# Altium project MEGAphone.PrjPcb (part 2 of 2)

## Sheet Audio.SchDoc: AUDIO
size A4; DrawnBy: D KLEISS; Revision: 1; SheetNumber: 3; SheetTotal: 15
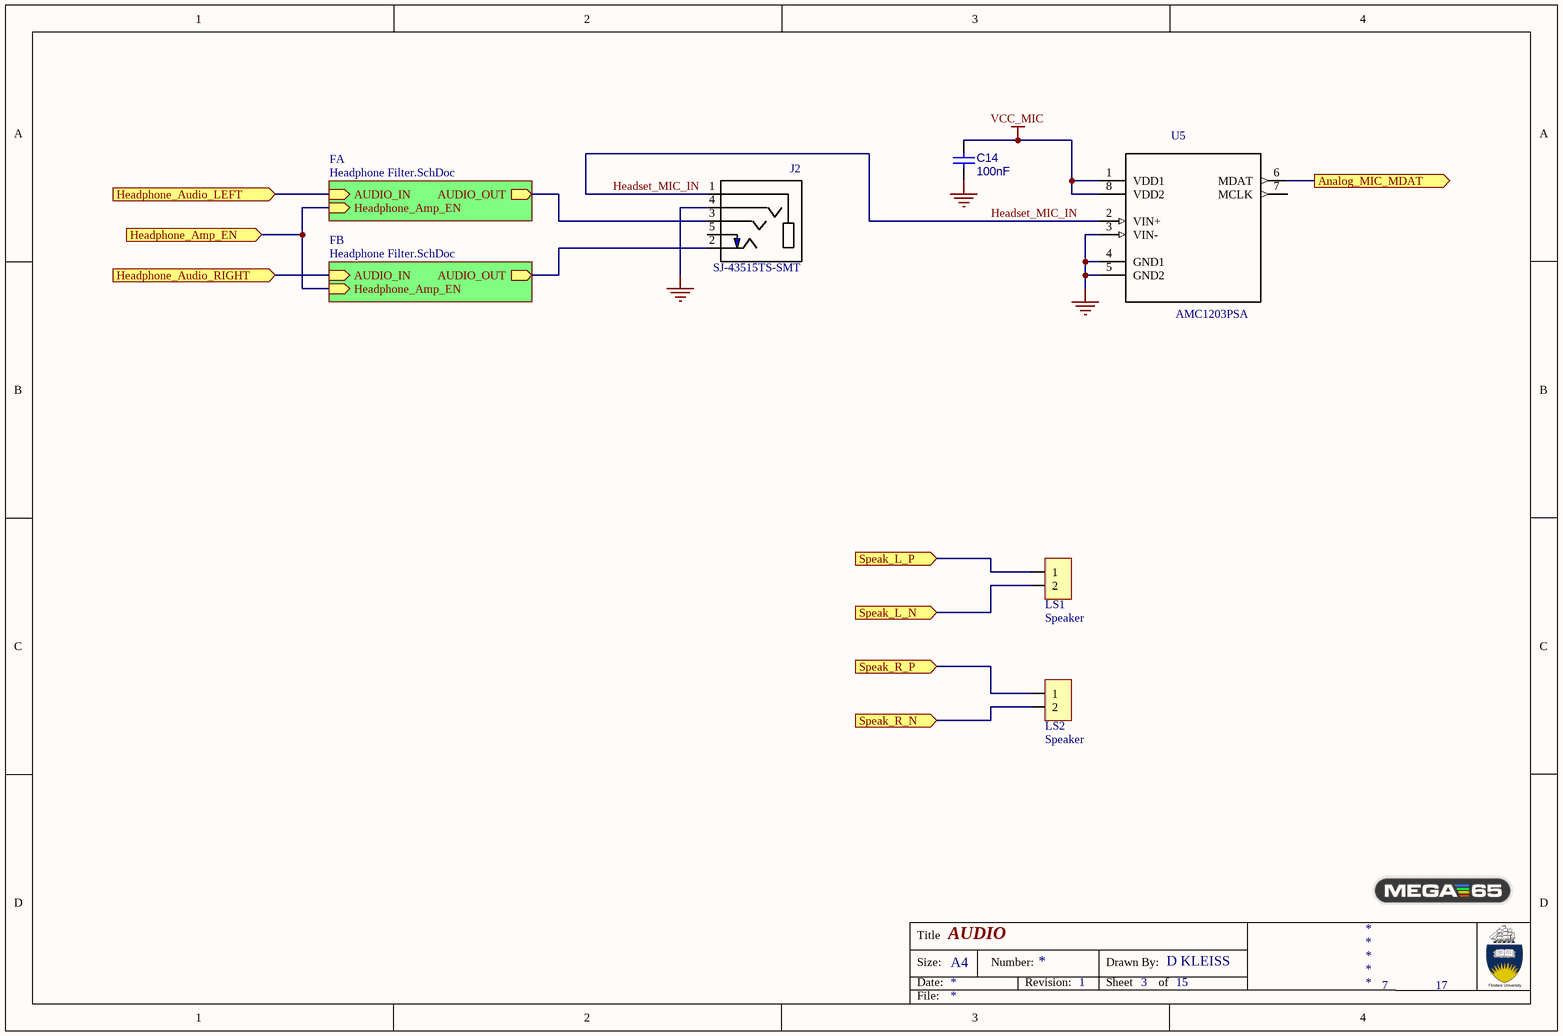
[diagram p9: Audio.SchDoc]

### Parts
C14  100nF  [0603_CAP UF HD]
J2  SJ-43515TS-SMT  [SOCKET 3.5 TRRS CUI_SJ-43515TS-SMT]
LS1  Speaker  [HDR1X2]
LS2  Speaker  [HDR1X2]
U5  AMC1203PSA  [AMC1203]

### Sub-sheets
FA = Headphone Filter.SchDoc: AUDIO_IN (in), AUDIO_OUT (out), Headphone_Amp_EN (in)
FB = Headphone Filter.SchDoc: AUDIO_IN (in), AUDIO_OUT (out), Headphone_Amp_EN (in)

### Ports
Analog_MIC_MDAT (out), Headphone_Amp_EN (in), Headphone_Audio_LEFT (in), Headphone_Audio_RIGHT (in), Speak_L_N (in), Speak_L_P (in), Speak_R_N (in), Speak_R_P (in)

### Nets
GND: C14.2 J2.4(RING2) U5.3(VIN-) U5.4(GND1) U5.5(GND2)
VCC_MIC: C14.1 U5.1(VDD1) U5.8(VDD2)
Headset_MIC_IN: J2.1(SLEEVE) U5.2(VIN+)
NetESP1_8: LS1.1 ; port Speak_L_P
NetESP1_10: LS1.2 ; port Speak_L_N
NetESP1_12: LS2.1 ; port Speak_R_P
NetESP1_14: LS2.2 ; port Speak_R_N
NetF2_FA_2: J2.3(RING1) ; sheet FA/AUDIO_OUT
NetF2_FB_2: J2.2(TIP) ; sheet FB/AUDIO_OUT
NetR17_FA_2: port Headphone_Audio_LEFT, sheet FA/AUDIO_IN
NetR17_FB_2: port Headphone_Audio_RIGHT, sheet FB/AUDIO_IN
NetU5_6: U5.6(MDAT) ; port Analog_MIC_MDAT
NetU11_FA_5: port Headphone_Amp_EN, sheet FA/Headphone_Amp_EN, sheet FB/Headphone_Amp_EN

Not connected (* = marked no-connect by the designer): J2 5(TIP_SWITCH); U5 7(MCLK)

### Notes on the sheet
- 7
- 17
- Title
- Size:
- Date:
- A4
- Number:
- Revision:
- Sheet
- Drawn By:
- of
- File:

### Library data of the parts
C14 = Cap: Capacitor; Value: 100nF
J2 = SJ-43515TS-SMT: SJ Series 3.5 mm 16 V 4 Conductor SMT Mid Mount Stereo Audio Jack; Manufacturer: CUI; Manufacturer Number: SJ-43515TS-SMT-TR; Digikey Number: CP-43515TSSJCT-ND
LS1 LS2 = CON2
U5 = AMC1203PSA: Single Channel Single ADC Delta-Sigma 40ksps 16-bit Serial 8-Pin SOP Tube; Manufacturer: Texas Instruments; Digikey Number: 296-27654-5-ND; Manufacturer Number: AMC1203PSA

## Sheet Headphone Filter.SchDoc: TITLE
size A4; DrawnBy: D Kleiss; Organization: Flinders University; Address1: College of Science & Engineering; Address2: Engineering Services Room 3.22; Address3: 1284 South Rd; Address4: SA 5042; DocumentNumber: A4; Revision: 1; SheetNumber: 1; SheetTotal: 1
Used 2 times, as channels U_Audio/FA, U_Audio/FB. Parts and nets are listed once, with the designators drawn on the sheet.
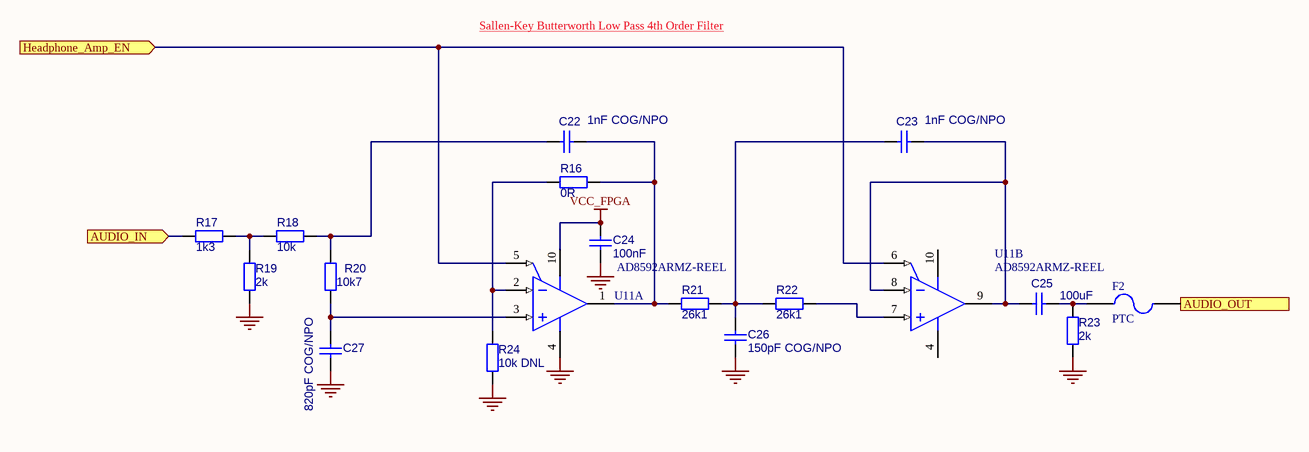
[diagram p10: Headphone Filter.SchDoc]

### Parts
C22  1nF COG/NPO  [0603_CAP PF HD]
C23  1nF COG/NPO  [0603_CAP PF HD]
C24  100nF  [0603_CAP UF HD]
C25  100uF  [1210-CAPACITOR UF]
C26  150pF COG/NPO  [0603_CAP PF HD]
C27  820pF COG/NPO  [0603_CAP PF HD]
F2  PTC  [0603-RESISTOR HD]
R16  0R  [0603-RESISTOR HD]
R17  1k3  [0603-RESISTOR HD]
R18  10k  [0603-RESISTOR HD]
R19  2k  [0603-RESISTOR HD]
R20  10k7  [0603-RESISTOR HD]
R21  26k1  [0603-RESISTOR HD]
R22  26k1  [0603-RESISTOR HD]
R23  2k  [0603-RESISTOR HD]
R24  10k DNL  [0603-RESISTOR HD]
U11  AD8592ARMZ-REEL  [ADI-RM-10_M]  (parts A,B of 2)

### Ports
AUDIO_IN (in), AUDIO_OUT (out), Headphone_Amp_EN (in)

### Nets
GND: C24.2 C26.1 C27.2 R19.2 R23.2 R24.2 U11.4(-V)
VCC_FPGA: C24.1 U11.10(+V)
AUDIO_IN: R17.2 ; port AUDIO_IN
AUDIO_OUT: F2.2 ; port AUDIO_OUT
Headphone_Amp_EN: U11.5(~{SDA}) U11.6(~{SDB}) ; port Headphone_Amp_EN
NetC22_1: C22.1 R18.2 R20.2
NetC22_2: C22.2 R16.1 R21.2 U11.1(OUT_A)
NetC23_1: C23.1 C26.2 R21.1 R22.1
NetC23_2: C23.2 C25.1 U11.8(-IN_B) U11.9(OUT_B)
NetC25_2: C25.2 F2.1 R23.1
NetC27_1: C27.1 R20.1 U11.3(+IN_A)
NetR16_2: R16.2 R24.1 U11.2(-IN_A)
NetR17_1: R17.1 R18.1 R19.1
NetR22_2: R22.2 U11.7(+IN_B)

### Channels
U_Audio/FA: designators end in _FA; ports AUDIO_IN=NetR17_FA_2 AUDIO_OUT=NetF2_FA_2 Headphone_Amp_EN=NetU11_FA_5
U_Audio/FB: designators end in _FB; ports AUDIO_IN=NetR17_FB_2 AUDIO_OUT=NetF2_FB_2 Headphone_Amp_EN=NetU11_FA_5

### Notes on the sheet
- Sallen-Key Butterworth Low Pass 4th Order Filter
- Title
- Size:
- Date:
- A4
- Number:
- Revision:
- Sheet
- Drawn By:
- of
- File:

### Library data of the parts
C22 C23 = Cap: Capacitor; Manufacturer: Wurth Electronics Inc.; Manufacturer Number: 885012006029; Value: 1nF COG/NPO; Digikey Number: 732-7771-1-ND
C24 C26 C27 = Cap: Capacitor
  C24: Value: 100nF
  C26: Value: 150pF COG/NPO
  C27: Value: 820pF COG/NPO; Digikey Number: 732-7771-1-ND
C25 = Cap: Capacitor; Manufacturer: Taiyo Yuden; Manufacturer Number: LMK325BJ107MM-T; Value: 100uF; Digikey Number: 587-1965-1-ND
F2 = Fuse: Manufacturer: Murata Electronics; Manufacturer Number: PRG18BB330MB1RB; Digikey Number: 490-2471-1-ND
R16-R24 = Resistor
  R16: Value: 0R
  R17: Value: 1k3
  R18: Value: 10k
  R19 R23: Value: 2k
  R20: Value: 10k7
  R21 R22: Value: 26k1
  R24: Value: 10k DNL
U11 = AD8592ARMZ-REEL: Double Channel Wide Bandwidth Operational Amplifier, 2.2 MHz BW, 3.5 V/us SR, Industrial, 10-pin SOP (RM-10), Reel; Manufacturer: Analog Devices; Digikey Number: AD8592ARMZ-REELCT-ND; Manufacturer Number: AD8592ARMZ-REEL

## Sheet 4G Modem.SchDoc: TITLE
size A3; DrawnBy: D Kleiss; Organization: Flinders University; Address1: College of Science & Engineering; Address2: Engineering Services Room 3.22; Address3: 1284 South Rd; Address4: SA 5042; DocumentNumber: A4; Revision: 1; SheetNumber: 1; SheetTotal: 1
Used 2 times, as channels M1, M2. Parts and nets are listed once, with the designators drawn on the sheet.
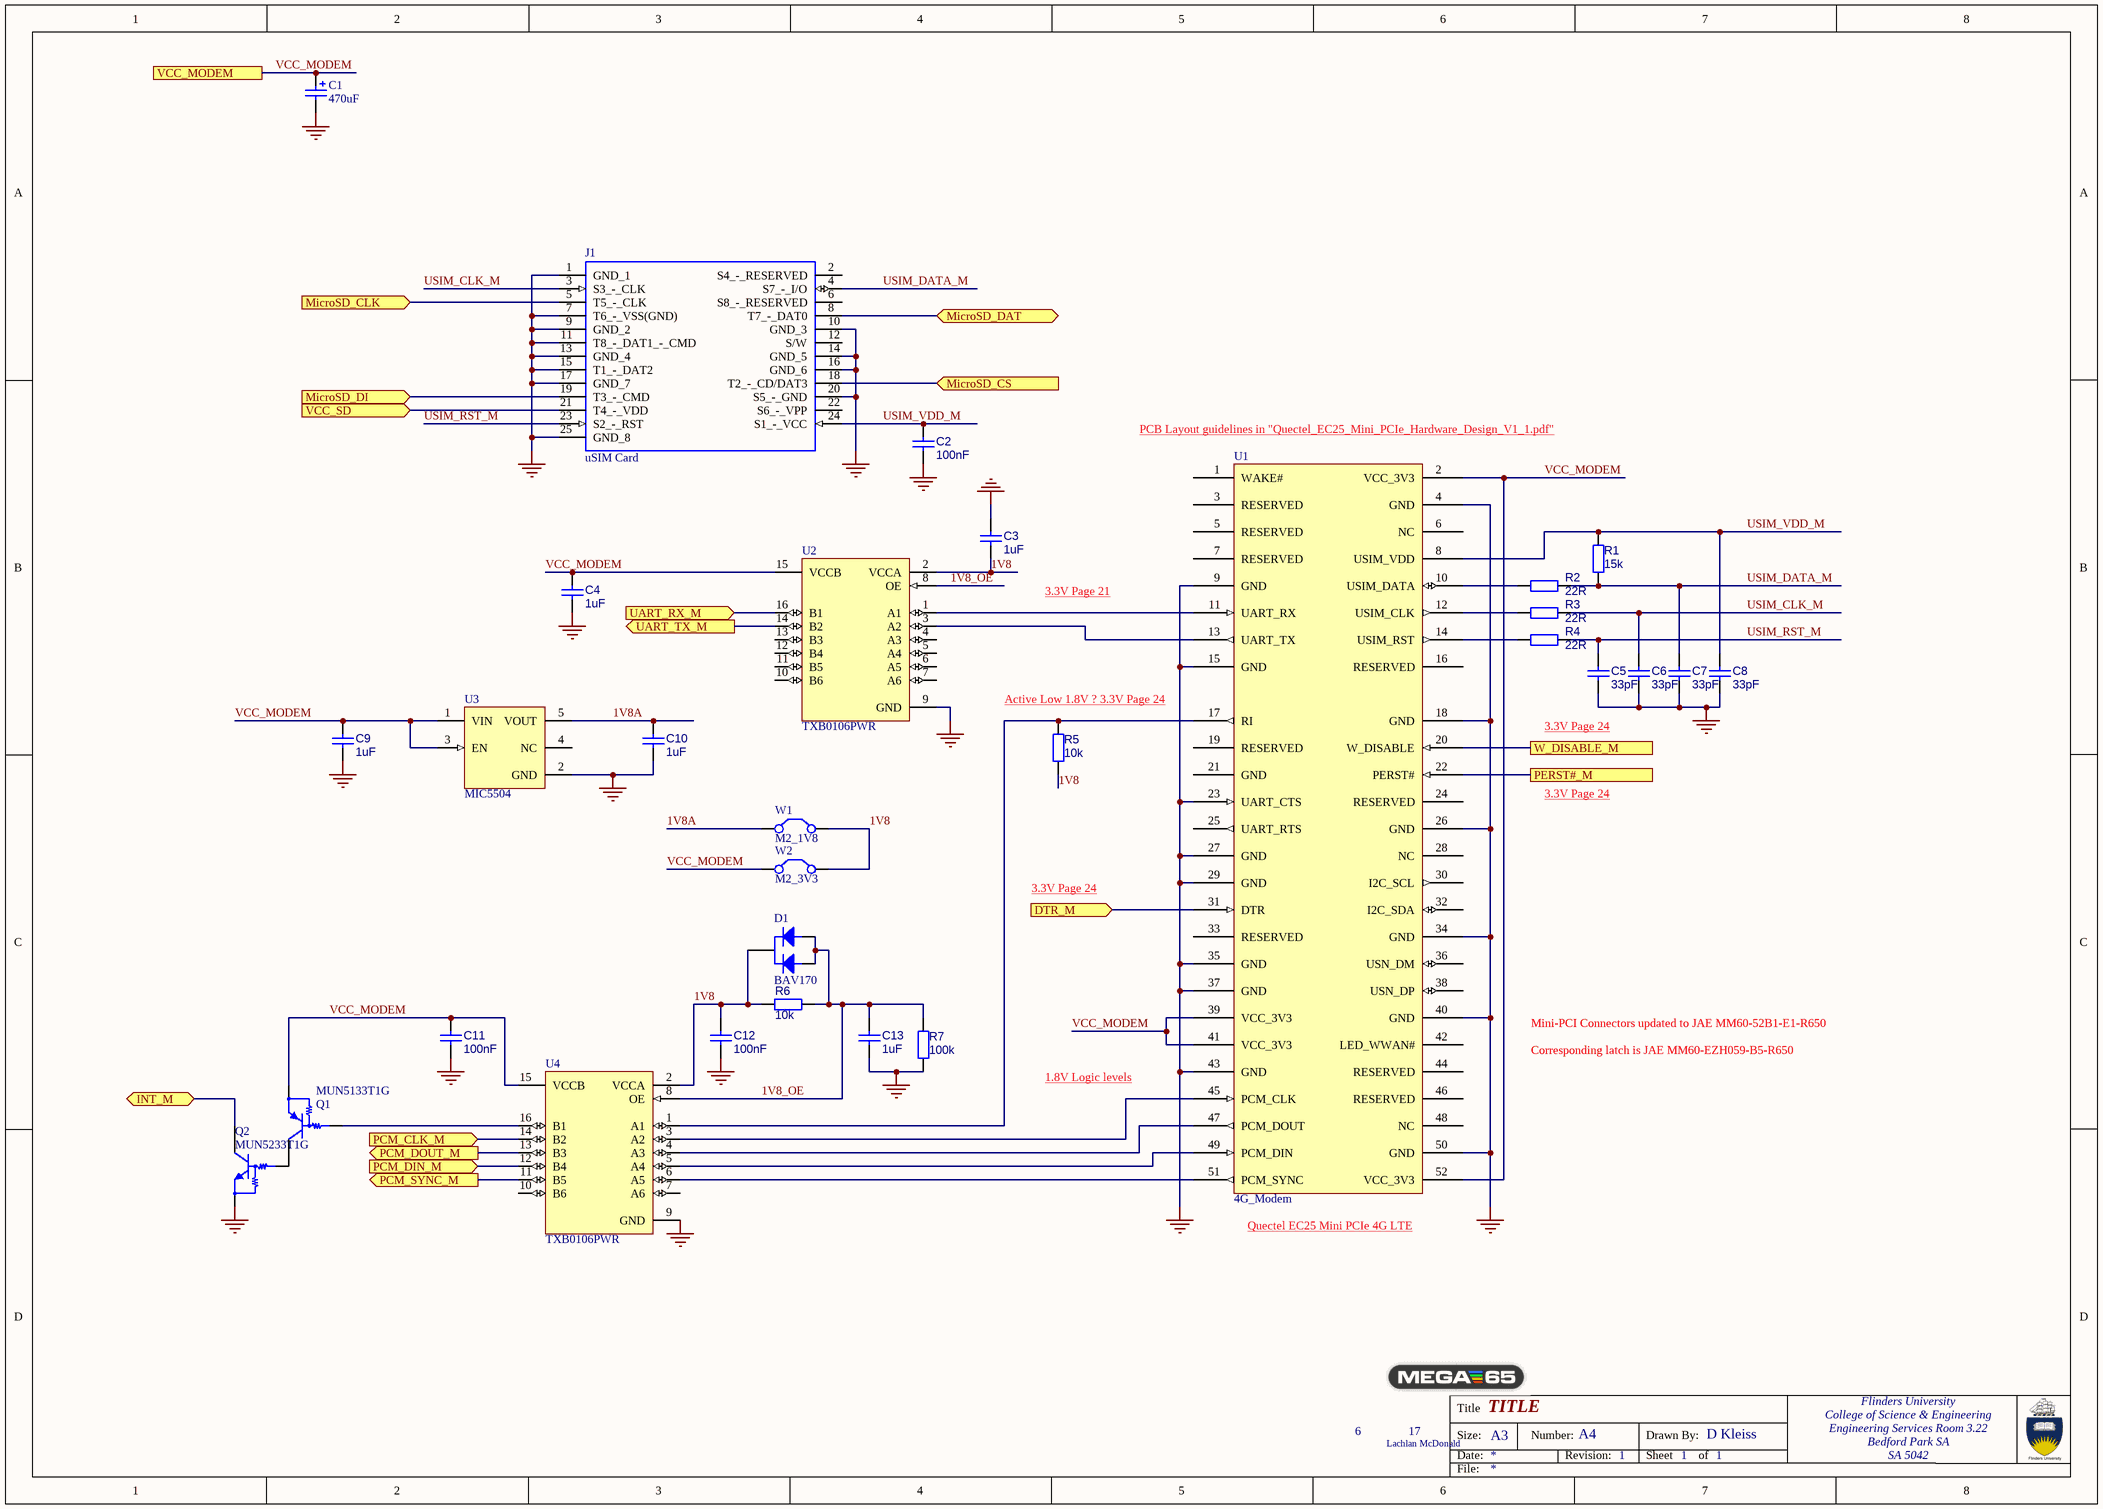
[diagram p11: 4G Modem.SchDoc]

### Parts
C1  470uF  [CAP Case D Tantalum]
C2  100nF  [0603_CAP UF HD]
C3  1uF  [0603_CAP UF HD]
C4  1uF  [0603_CAP UF HD]
C5  33pF  [0603_CAP PF HD]
C6  33pF  [0603_CAP PF HD]
C7  33pF  [0603_CAP PF HD]
C8  33pF  [0603_CAP PF HD]
C9  1uF  [0603_CAP UF HD]
C10  1uF  [0603_CAP UF HD]
C11  100nF  [0603_CAP UF HD]
C12  100nF  [0603_CAP UF HD]
C13  1uF  [0603_CAP UF HD]
D1  BAV170  [SOT-23]
J1  uSIM Card  [CONNECTOR MSIM MOLEX 1046421610]
Q1  MUN5133T1G  [SC70-3 (SOT-323)]
Q2  MUN5233T1G  [SC70-3 (SOT-323)]
R1  15k  [0603-RESISTOR HD]
R2  22R  [0603-RESISTOR HD]
R3  22R  [0603-RESISTOR HD]
R4  22R  [0603-RESISTOR HD]
R5  10k  [0603-RESISTOR HD]
R6  10k  [0603-RESISTOR HD]
R7  100k  [0603-RESISTOR HD]
U1  4G_Modem  [CONNECTOR MINI PCIE MOLEX_67910001]
U2  TXB0106PWR  [TSSOP-16]
U3  MIC5504  [SOT-23-5]
U4  TXB0106PWR  [TSSOP-16]
W1  M2_1V8  [0603-RESISTOR HD]
W2  M2_3V3  [0603-RESISTOR HD]

### Ports
DTR_M (in), INT_M (bidir), MicroSD_CLK (in), MicroSD_CS (in), MicroSD_DAT (bidir), MicroSD_DI (in), PCM_CLK_M (in), PCM_DIN_M (in), PCM_DOUT_M (out), PCM_SYNC_M (out), PERST#_M, UART_RX_M (in), UART_TX_M (out), VCC_MODEM, VCC_SD (in), W_DISABLE_M

### Nets
GND: C1.2 C2.2 C3.2 C4.2 C5.2 C6.2 C7.2 C8.2 C9.2 C10.2 C11.2 C12.2 C13.2 J1.1(GND_1) J1.7(T6_-_VSS(GND)) J1.9(GND_2) J1.10(GND_3) J1.11(T8_-_DAT1_-_CMD) J1.13(GND_4) J1.14(GND_5) J1.15(T1_-_DAT2) J1.16(GND_6) J1.17(GND_7) J1.20(S5_-_GND) J1.25(GND_8) Q2.1(E) R7.2 U1.4(GND) U1.9(GND) U1.15(GND) U1.18(GND) U1.23(UART_CTS) U1.26(GND) U1.27(GND) U1.29(GND) U1.34(GND) U1.35(GND) U1.37(GND) U1.40(GND) U1.43(GND) U1.50(GND) U2.9(GND) U3.2(GND) U4.9(GND)
1V8: C3.1 C12.1 D1.3(K) R5.1 R6.1 U2.2(VCCA) U4.2(VCCA) W1.2(C2) W2.2(C2)
1V8_OE: C13.1 D1.1(A1) D1.2(A2) R6.2 R7.1 U2.8(OE) U4.8(OE)
1V8A: C10.1 U3.5(VOUT) W1.1(C1)
DTR_M: U1.31(DTR) ; port DTR_M
INT_M: Q2.3(C) ; port INT_M
MicroSD_CLK: J1.5(T5_-_CLK) ; port MicroSD_CLK
MicroSD_CS: J1.18(T2_-_CD/DAT3) ; port MicroSD_CS
MicroSD_DAT: J1.8(T7_-_DAT0) ; port MicroSD_DAT
MicroSD_DI: J1.19(T3_-_CMD) ; port MicroSD_DI
PCM_CLK_M: U4.14(B2) ; port PCM_CLK_M
PCM_DIN_M: U4.12(B4) ; port PCM_DIN_M
PCM_DOUT_M: U4.13(B3) ; port PCM_DOUT_M
PCM_SYNC_M: U4.11(B5) ; port PCM_SYNC_M
PERST#_M: U1.22(PERST#) ; port PERST#_M
UART_RX_M: U2.16(B1) ; port UART_RX_M
UART_TX_M: U2.14(B2) ; port UART_TX_M
USIM_CLK_M: C6.1 J1.3(S3_-_CLK) R3.1
USIM_DATA_M: C7.1 J1.4(S7_-_I/O) R1.2 R2.1
USIM_RST_M: C5.1 J1.23(S2_-_RST) R4.1
USIM_VDD_M: C2.1 C8.1 J1.24(S1_-_VCC) R1.1 U1.8(USIM_VDD)
VCC_MODEM: C1.1 C4.1 C9.1 C11.1 Q1.2(E) U1.2(VCC_3V3) U1.39(VCC_3V3) U1.41(VCC_3V3) U1.52(VCC_3V3) U2.15(VCCB) U3.1(VIN) U3.3(EN) U4.15(VCCB) W2.1(C1) ; port VCC_MODEM
VCC_SD: J1.21(T4_-_VDD) ; port VCC_SD
W_DISABLE_M: U1.20(W_DISABLE) ; port W_DISABLE_M
NetQ1_1: Q1.1(B) U4.16(B1)
NetQ1_3: Q1.3(C) Q2.2(B)
NetR2_2: R2.2 U1.10(USIM_DATA)
NetR3_2: R3.2 U1.12(USIM_CLK)
NetR4_2: R4.2 U1.14(USIM_RST)
NetR5_2: R5.2 U1.17(RI) U4.1(A1)
NetU1_11: U1.11(UART_RX) U2.1(A1)
NetU1_13: U1.13(UART_TX) U2.3(A2)
NetU1_45: U1.45(PCM_CLK) U4.3(A2)
NetU1_47: U1.47(PCM_DOUT) U4.4(A3)
NetU1_49: U1.49(PCM_DIN) U4.5(A4)
NetU1_51: U1.51(PCM_SYNC) U4.6(A5)

Not connected (* = marked no-connect by the designer): J1 2(S4_-_RESERVED) 6(S8_-_RESERVED) 12(S/W) 22(S6_-_VPP); U1 1(WAKE#) 3(RESERVED) 5(RESERVED) 6(NC) 7(RESERVED) 16(RESERVED) 19(RESERVED) 21(GND) 24(RESERVED) 25(UART_RTS) 28(NC) 30(I2C_SCL) 32(I2C_SDA) 33(RESERVED) 36(USN_DM) 38(USN_DP) 42(LED_WWAN#) 44(RESERVED) 46(RESERVED) 48(NC); U2 4(A3) 5(A4) 6(A5) 7(A6) 10(B6) 11(B5) 12(B4) 13(B3); U3 4(NC); U4 7(A6) 10(B6)

### Channels
M1: designators end in _M1; ports DTR_M=NetU1_M1_31 INT_M=INT MicroSD_CLK=NetJ1_M1_5 MicroSD_CS=NetJ1_M1_18 MicroSD_DAT=NetJ1_M1_8 MicroSD_DI=NetJ1_M1_8 PCM_CLK_M=NetU4_M1_14 PCM_DIN_M=NetU4_M1_12 PCM_DOUT_M=NetU4_M1_13 PCM_SYNC_M=NetU4_M1_11 PERST#_M=NetU1_M1_22 UART_RX_M=UART_RX_M1 UART_TX_M=UART_TX_M1 VCC_MODEM=VCC_MODEM VCC_SD=VCC_FPGA W_DISABLE_M=NetU1_M1_20
M2: designators end in _M2; ports DTR_M=NetU1_M2_31 INT_M=INT MicroSD_CLK=NetJ1_M1_5 MicroSD_CS=NetJ1_M1_18 MicroSD_DAT=NetJ1_M1_8 MicroSD_DI=NetJ1_M1_8 PCM_CLK_M=NetU4_M2_14 PCM_DIN_M=NetU4_M2_12 PCM_DOUT_M=NetU4_M2_13 PCM_SYNC_M=NetU4_M2_11 PERST#_M=NetU1_M2_22 UART_RX_M=UART_RX_M2 UART_TX_M=UART_TX_M2 VCC_MODEM=VCC_MODEM VCC_SD=VCC_FPGA W_DISABLE_M=NetU1_M2_20

### Notes on the sheet
- (near U1) PCB Layout guidelines in "Quectel_EC25_Mini_PCIe_Hardware_Design_V1_1.pdf"
- 3.3V Page 21
- (near R5) Active Low 1.8V ? 3.3V Page 24
- 3.3V Page 24
- Mini-PCI Connectors updated to JAE MM60-52B1-E1-R650
- Corresponding latch is JAE MM60-EZH059-B5-R650
- 1.8V Logic levels
- (near U1) Quectel EC25 Mini PCIe 4G LTE
- 6
- Lachlan McDonald
- 17
- Title
- Size:
- Date:
- A3
- Number:
- Revision:
- Sheet
- Drawn By:
- of
- Bedford Park SA
- File:

### Library data of the parts
C1 = Cap Pol: Polarized Capacitor (Radial); Manufacturer: AVX Corporation; Manufacturer Number: TPSD477K006R0060; Value: 470uF; Digikey Number: 478-11421-1-ND
C2 C5-C8 C11 C12 = Cap: Capacitor
  C2 C11 C12: Value: 100nF
  C5-C8: Value: 33pF
C3 C4 C9 C10 C13 = Cap: Capacitor; Manufacturer: Samsung; Manufacturer Number: CL10B105MO8NNWC; Value: 1uF; Digikey Number: 1276-6524-1-ND
D1 = BAV170: Dual Common Cathode Silicon Low Leakage Diode 3-Pin SOT-23; Manufacturer: Infineon Technologies; Manufacturer Number: BAV170E6327HTSA1; Digikey Number: BAV170E6327HTSA1CT-ND
J1 = 104642-1610: Molex 104642 Series 8 Way Micro SIM, MicroSD Memory Card Connector with Solder Termination; RS Part Number: 1213817P; Digikey Number: WM12958CT-ND; Manufacturer: Molex; Manufacturer Number: 104642-1610
Q1 = Transistor PNP Prebiased: PNP Bipolar Transistor, Prebiased; Manufacturer: ON Semiconductor; Manufacturer Number: MUN5133T1G; Digikey Number: MUN5133T1GOSCT-ND
Q2 = Transistor NPN Prebiased: NPN Bipolar Transistor, Prebiased; Manufacturer: ON Semiconductor; Manufacturer Number: MUN5233T1G; Digikey Number: MUN5233T1GOSCT-ND
R1-R7 = Resistor
  R1: Value: 15k
  R2-R4: Value: 22R
  R5 R6: Value: 10k
  R7: Value: 100k
U1 = 4G_Modem: Manufacturer: JAE; Manufacturer Number: MM60-52B1-E1-R650; Digikey Number: 670-2275-1-ND
U2 U4 = TXB0106PWR: 6-Bit Bidirectional Level-Shifting and Voltage Translator with Auto-Direction Sensing and +/- 15-kV ESD Protection, 1.2 to 3.6 V, -40 to 85 degC, 16-Pin TSSOP (PW), Green (RoHS & no Sb/Br), Tape and Reel; Manufacturer: Texas Instruments; Manufacturer Number: TXB0106PWR; Digikey Number: 296-23759-1-ND
U3 = MIC5504: 300 mA Single Output LDO in Small Packages; Manufacturer: Microchip; Manufacturer Number: MIC5504-1.8YM5-TR; Digikey Number: 576-4879-1-ND
W1 W2 = Jumper: Jumper Wire; Published: 24-Mar-1999; LatestRevisionDate: 17-Jul-2002; LatestRevisionNote: Re-released for DXP Platform.; PackageReference: RAD-0.2; Publisher: Altium Limited; PackageDescription: Radial Cap, Thru-Hole; 2 Leads; 0.2 in Pin Spacing

## Sheet LoRa Radio.SchDoc
size A4
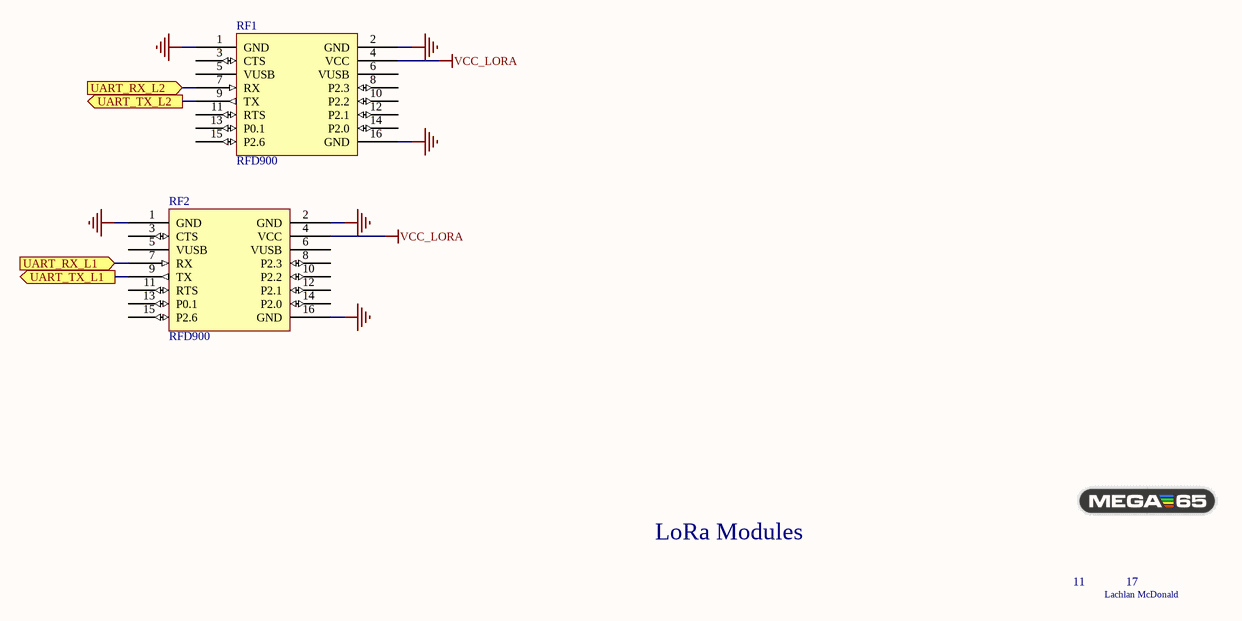
[diagram p12: LoRa Radio.SchDoc]

### Parts
RF1  RFD900  [RFD900]
RF2  RFD900  [RFD900]

### Ports
UART_RX_L1 (in), UART_RX_L2 (in), UART_TX_L1 (out), UART_TX_L2 (out)

### Nets
GND: RF1.1(GND) RF1.2(GND) RF1.16(GND) RF2.1(GND) RF2.2(GND) RF2.16(GND)
VCC_LORA: RF1.4(VCC) RF2.4(VCC)
NetRF1_7: RF1.7(RX) ; port UART_RX_L2
NetRF1_9: RF1.9(TX) ; port UART_TX_L2
NetRF2_7: RF2.7(RX) ; port UART_RX_L1
NetRF2_9: RF2.9(TX) ; port UART_TX_L1

Not connected (* = marked no-connect by the designer): RF1 3(CTS) 5(VUSB) 6(VUSB) 8(P2.3) 10(P2.2) 11(RTS) 12(P2.1) 13(P0.1) 14(P2.0) 15(P2.6); RF2 3(CTS) 5(VUSB) 6(VUSB) 8(P2.3) 10(P2.2) 11(RTS) 12(P2.1) 13(P0.1) 14(P2.0) 15(P2.6)

### Notes on the sheet
- LoRa Modules
- 11
- 17
- Lachlan McDonald
- Title
- Size:
- Date:
- A4
- Number:
- Revision:
- Sheet
- Drawn By:
- of
- File:

## Sheet Bluetooth & WIFI.SchDoc: BLUETOOTH & WiFi
size A4
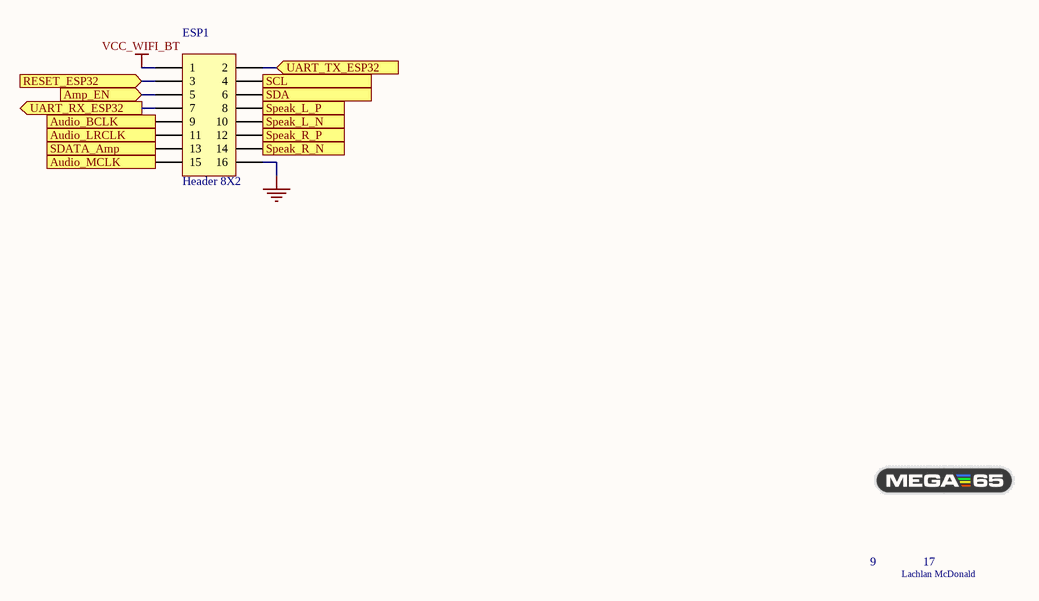
[diagram p13: Bluetooth & WIFI.SchDoc]

### Parts
ESP1  Header 8X2  [HDR2X8]

### Ports
Amp_EN (in), Audio_BCLK (in), Audio_LRCLK (in), Audio_MCLK (in), RESET_ESP32 (in), SCL (in), SDA (out), SDATA_Amp (in), Speak_L_N (out), Speak_L_P (out), Speak_R_N (out), Speak_R_P (out), UART_RX_ESP32 (out), UART_TX_ESP32 (in)

### Nets
GND: ESP1.16
VCC_WIFI_BT: ESP1.1
RESET_ESP32: ESP1.3 ; port RESET_ESP32
SCL: ESP1.4 ; port SCL
SDA: ESP1.6 ; port SDA
UART_RX_ESP32: ESP1.7 ; port UART_RX_ESP32
UART_TX_ESP32: ESP1.2 ; port UART_TX_ESP32
NetESP1_5: ESP1.5 ; port Amp_EN
NetESP1_8: ESP1.8 ; port Speak_L_P
NetESP1_9: ESP1.9 ; port Audio_BCLK
NetESP1_10: ESP1.10 ; port Speak_L_N
NetESP1_11: ESP1.11 ; port Audio_LRCLK
NetESP1_12: ESP1.12 ; port Speak_R_P
NetESP1_13: ESP1.13 ; port SDATA_Amp
NetESP1_14: ESP1.14 ; port Speak_R_N
NetESP1_15: ESP1.15 ; port Audio_MCLK

### Notes on the sheet
- 9
- 17
- Lachlan McDonald
- Title
- Size:
- Date:
- A4
- Number:
- Revision:
- Sheet
- Drawn By:
- of
- File:

### Library data of the parts
ESP1 = Header 8X2: Header, 8-Pin, Dual row; LatestRevisionDate: 17-Jul-2002; LatestRevisionNote: Re-released for DXP Platform.; Publisher: Altium Limited

## Sheet Sensors.SchDoc: MEGAPHONE Sensors
size A4; DrawnBy: D Kleiss; Organization: Flinders University; Address1: College of Science & Engineering; Address2: Engineering Services Room 3.22; Address3: 1284 South Rd; Address4: SA 5042; DocumentNumber: A4284; Revision: 1; SheetNumber: 5; SheetTotal: 15
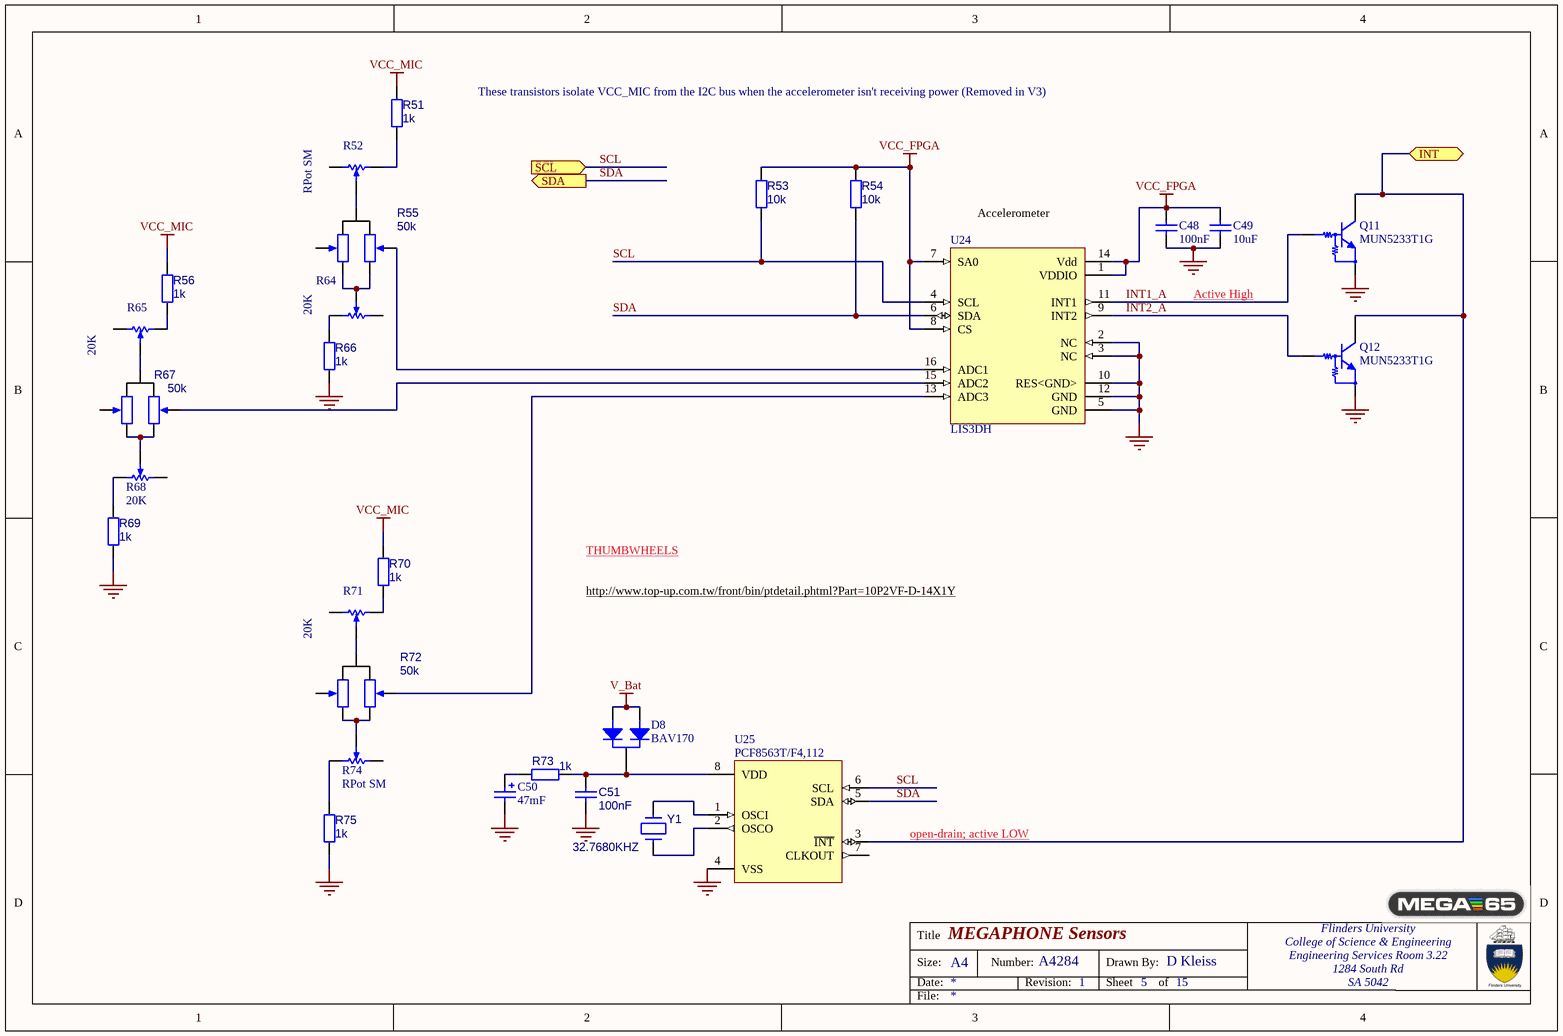
[diagram p14: Sensors.SchDoc]

### Parts
C48  100nF  [CAPC0805(2012)100_N]
C49  10uF  [CAPC0805(2012)100_N]
C50  47mF  [CAP SMD 10.5D 5.5H]
C51  100nF  [0603_CAP UF HD]
D8  BAV170  [SOT-23]
Q11  MUN5233T1G  [SC70-3 (SOT-323)]
Q12  MUN5233T1G  [SC70-3 (SOT-323)]
R51  1k  [0603-RESISTOR HD]
R52  RPot SM  [POT4MM-2]
R53  10k  [0603-RESISTOR HD]
R54  10k  [0603-RESISTOR HD]
R55  50k  [POT 10P2VF-D-141Y]
R56  1k  [0603-RESISTOR HD]
R64  20K  [POT4MM-2]
R65  20K  [POT4MM-2]
R66  1k  [0603-RESISTOR HD]
R67  50k  [POT 10P2VF-D-141Y]
R68  20K  [POT4MM-2]
R69  1k  [0603-RESISTOR HD]
R70  1k  [0603-RESISTOR HD]
R71  20K  [POT4MM-2]
R72  50k  [POT 10P2VF-D-141Y]
R73  1k  [0603-RESISTOR HD]
R74  RPot SM  [POT4MM-2]
R75  1k  [0603-RESISTOR HD]
U24  LIS3DH  [LGA-16_3x3x1mm]
U25  PCF8563T/F4,112  [SOIC-8-H_SLDR]
Y1  32.7680KHZ  [FC-135]

### Ports
INT (bidir), SCL (in), SDA (out)

### Nets
GND: C48.2 C49.2 C50.2 C51.2 Q11.1(E) Q12.1(E) R66.2 R69.2 R75.2 U24.2(NC) U24.3(NC) U24.5(GND) U24.10(RES<GND>) U24.12(GND) U25.4(VSS)
V_Bat: D8.1(A1) D8.2(A2)
VCC_FPGA: C48.1 C49.1 R53.1 R54.1 U24.1(VDDIO) U24.7(SA0) U24.8(CS) U24.14(Vdd)
VCC_MIC: R51.1 R56.1 R70.1
INT: Q11.3(C) Q12.3(C) U25.3(~{INT}) ; port INT
INT1_A: Q11.2(B) U24.11(INT1)
INT2_A: Q12.2(B) U24.9(INT2)
SCL: R53.2 U24.4(SCL) U25.6(SCL) ; port SCL
SDA: R54.2 U24.6(SDA) U25.5(SDA) ; port SDA
NetC50_1: C50.1 R73.2
NetC51_1: C51.1 D8.3(K) R73.1 U25.8(VDD)
NetR51_2: R51.2 R52.CW(+)
NetR52_W: R52.W R55.1
NetR55_2A: R55.2A U24.16(ADC1)
NetR55_3A: R55.3A R55.3B R64.W
NetR56_2: R56.2 R65.CW(+)
NetR64_CW: R64.CW(+) R66.1
NetR65_W: R65.W R67.1
NetR67_2A: R67.2A U24.15(ADC2)
NetR67_3A: R67.3A R67.3B R68.W
NetR68_CW: R68.CW(+) R69.1
NetR70_2: R70.2 R71.CW(+)
NetR71_W: R71.W R72.1
NetR72_2A: R72.2A U24.13(ADC3)
NetR72_3A: R72.3A R72.3B R74.W
NetR74_CW: R74.CW(+) R75.1
NetU25_1: U25.1(OSCI) Y1.2
NetU25_2: U25.2(OSCO) Y1.1

Not connected (* = marked no-connect by the designer): R52 CCW(-); R55 2B; R64 CCW(-); R65 CCW(-); R67 2B; R68 CCW(-); R71 CCW(-); R72 2B; R74 CCW(-); U25 7(CLKOUT)

### Notes on the sheet
- These transistors isolate VCC_MIC from the I2C bus when the accelerometer isn't receiving power (Removed in V3)
- (near U24) Accelerometer
- Active High
- THUMBWHEELS
- http://www.top-up.com.tw/front/bin/ptdetail.phtml?Part=10P2VF-D-14X1Y
- open-drain; active LOW
- Title
- Size:
- Date:
- A4
- Number:
- Revision:
- Sheet
- Drawn By:
- of
- File:

### Library data of the parts
C48 C49 = CMP-1036-01531-1: 0805 (2012 Metric); Tolerance: Â±2%; Rated Voltage: 100 V; Case-Metric: 2012; Case-EIA: 0805; Value: 39pF; Technology: SMT; Max Thickness: 1 mm
C50 = Cap Pol: Polarized Capacitor (Radial); Manufacturer: KEMET; Manufacturer Number: FC0H473ZFTBR24; Value: 47mF; Digikey Number: 399-10938-1-ND
C51 = Cap: Capacitor; Value: 100nF
D8 = BAV170: as D1 on sheet 4G Modem; Digikey Number: BAV170E6327HTSA1CT-ND
Q11 Q12 = Transistor NPN Prebiased: as Q2 on sheet 4G Modem; Manufacturer Number: MUN5233T1G; Digikey Number: MUN5233T1GOSCT-ND
R51 R53 R54 R56 R66 R69 R70 R73 R75 = Resistor
  R51 R56 R66 R69 R70 R73 R75: Value: 1k
  R53 R54: Value: 10k
R52 R64 R65 R68 R71 R74 = RPot SM: Square Trimming Potentiometer; Published: 17-Dec-2003; DatasheetVersion: Oct-2003; PackageReference: POT4MM-2; Publisher: Altium Limited; PackageDescription: Square Trimming Potentiometer; ComponentLink1Description: Manufacturer Link; ComponentLink1URL: http://bourns.com/2/search.html
R55 R67 R72 = Resistor Potentiometer Dual: Resistor; Manufacturer: TOP UP Industry; Manufacturer Number: 10P2VF-D-14X1Y; Value: 50k
U24 = LIS3DH: Accelerometer; Digikey Number: 497-10610-ND
U25 = PCF8563T/F4,112: PCF8563 Series 1.8 - 5.5 V 250 mA Real-time Clock/Calendar - SOIC-8
Y1 = CRYSTAL: Manufacturer: EPSON; Manufacturer Number: FC-135R 32.7680KA-AG3; Value: 32.7680KHZ; Digikey Number: SER4073CT-ND

## Sheet CM4.SchDoc
size A4
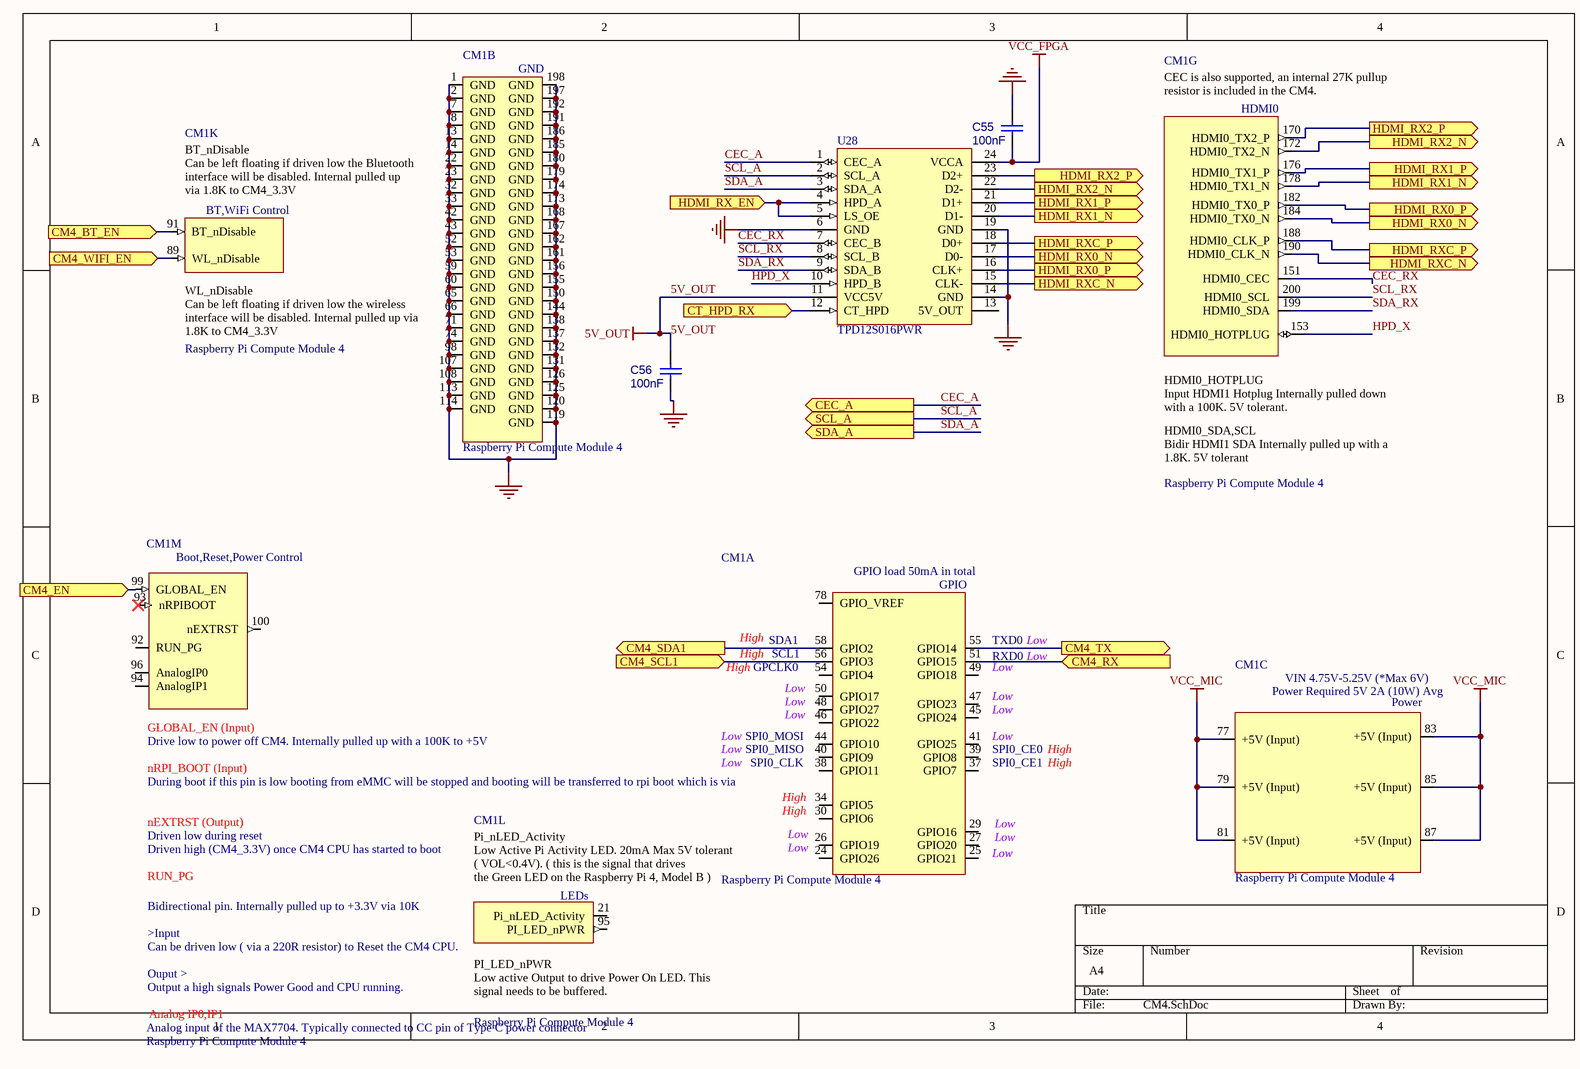
[diagram p15: CM4.SchDoc]

### Parts
C55  100nF  [0603_CAP UF HD]
C56  100nF  [0603_CAP UF HD]
CM1  Raspberry Pi Compute Module 4  [CM4-F40C-100DS-0.4v_1.5mm_0mm]  (parts A,B,C,G,K,L,M of 21)
U28  TPD12S016PWR  [SOP65P640X120-24N]

### Ports
CEC_A (out), CM4_BT_EN (in), CM4_EN (in), CM4_RX (in), CM4_SCL1 (in), CM4_SDA1 (out), CM4_TX (out), CM4_WIFI_EN (in), CT_HPD_RX (in), HDMI_RX0_N (out), HDMI_RX0_P (out), HDMI_RX1_N (out), HDMI_RX1_P (out), HDMI_RX2_N (out), HDMI_RX2_P (out), HDMI_RX_EN (in), HDMI_RXC_N (out), HDMI_RXC_P (out), SCL_A (out), SDA_A (out)

### Nets
5V_OUT: C56.1 U28.11(VCC5V)  [project net 5V_HDMI_A]
GND: C55.1 C56.2 CM1.1(GND) CM1.2(GND) CM1.7(GND) CM1.8(GND) CM1.13(GND) CM1.14(GND) CM1.22(GND) CM1.23(GND) CM1.32(GND) CM1.33(GND) CM1.42(GND) CM1.43(GND) CM1.52(GND) CM1.53(GND) CM1.59(GND) CM1.60(GND) CM1.65(GND) CM1.66(GND) CM1.71(GND) CM1.74(GND) CM1.98(GND) CM1.107(GND) CM1.108(GND) CM1.113(GND) CM1.114(GND) CM1.119(GND) CM1.120(GND) CM1.125(GND) CM1.126(GND) CM1.131(GND) CM1.132(GND) CM1.137(GND) CM1.138(GND) CM1.144(GND) CM1.150(GND) CM1.155(GND) CM1.156(GND) CM1.161(GND) CM1.162(GND) CM1.167(GND) CM1.168(GND) CM1.173(GND) CM1.174(GND) CM1.179(GND) CM1.180(GND) CM1.185(GND) CM1.186(GND) CM1.191(GND) CM1.192(GND) CM1.197(GND) CM1.198(GND) U28.6(GND) U28.14(GND) U28.19(GND)
VCC_FPGA: C55.2 U28.24(VCCA)
VCC_MIC: CM1.77(+5V_(Input)) CM1.79(+5V_(Input)) CM1.81(+5V_(Input)) CM1.83(+5V_(Input)) CM1.85(+5V_(Input)) CM1.87(+5V_(Input))
CEC_A: U28.1(CEC_A) ; port CEC_A
CEC_RX: CM1.151(HDMI0_CEC) U28.7(CEC_B)
CM4_RX: CM1.51(GPIO15) ; port CM4_RX
CM4_SCL1: CM1.56(GPIO3) ; port CM4_SCL1
CM4_SDA1: CM1.58(GPIO2) ; port CM4_SDA1
CM4_TX: CM1.55(GPIO14) ; port CM4_TX
HPD_X: CM1.153(HDMI0_HOTPLUG) U28.10(HPD_B)
SCL_A: U28.2(SCL_A) ; port SCL_A
SCL_RX: CM1.200(HDMI0_SCL) U28.8(SCL_B)
SDA_A: U28.3(SDA_A) ; port SDA_A
SDA_RX: CM1.199(HDMI0_SDA) U28.9(SDA_B)
NetCM1_89: CM1.89(WL_nDisable) ; port CM4_WIFI_EN
NetCM1_91: CM1.91(BT_nDisable) ; port CM4_BT_EN
NetCM1_99: CM1.99(GLOBAL_EN) ; port CM4_EN
NetCM1_170: CM1.170(HDMI0_TX2_P) U28.23(D2+) ; port HDMI_RX2_P
NetCM1_172: CM1.172(HDMI0_TX2_N) U28.22(D2-) ; port HDMI_RX2_N
NetCM1_176: CM1.176(HDMI0_TX1_P) U28.21(D1+) ; port HDMI_RX1_P
NetCM1_178: CM1.178(HDMI0_TX1_N) U28.20(D1-) ; port HDMI_RX1_N
NetCM1_182: CM1.182(HDMI0_TX0_P) U28.16(CLK+) ; port HDMI_RX0_P
NetCM1_184: CM1.184(HDMI0_TX0_N) U28.17(D0-) ; port HDMI_RX0_N
NetCM1_188: CM1.188(HDMI0_CLK_P) U28.18(D0+) ; port HDMI_RXC_P
NetCM1_190: CM1.190(HDMI0_CLK_N) U28.15(CLK-) ; port HDMI_RXC_N
NetU12_10: U28.4(HPD_A) U28.5(LS_OE) ; port HDMI_RX_EN
NetU14_19: U28.12(CT_HPD) ; port CT_HPD_RX

Not connected (* = marked no-connect by the designer): CM1 21(Pi_nLED_Activity) 24(GPIO26) 25(GPIO21) 26(GPIO19) 27(GPIO20) 29(GPIO16) 30(GPIO6) 34(GPIO5) 37(GPIO7) 38(GPIO11) 39(GPIO8) 40(GPIO9) 41(GPIO25) 44(GPIO10) 45(GPIO24) 46(GPIO22) 47(GPIO23) 48(GPIO27) 49(GPIO18) 50(GPIO17) 54(GPIO4) 78(GPIO_VREF) 92(RUN_PG) 93(nRPIBOOT)* 94(AnalogIP1) 95(PI_LED_nPWR) 96(AnalogIP0) 100(nEXTRST); U28 13(5V_OUT)

### Notes on the sheet
- (in symbol CM4, part A) GPIO load 50mA in total; GPIO; High; SDA1; TXD0; Low; SCL1; RXD0; GPCLK0; SPI0_MOSI; SPI0_MISO; SPI0_CE0; SPI0_CLK; SPI0_CE1; by Amornthep Phunsin
- (in symbol CM4, part C) VIN 4.75V-5.25V (*Max 6V); Power Required 5V 2A (10W) Avg; Power; by Amornthep Phunsin
- (in symbol CM4, part G) HDMI0; CEC is also supported, an internal 27K pullup resistor is included in the CM4.; HDMI0_HOTPLUG / Input HDMI1 Hotplug Internally pulled down with a 100K. 5V tolerant.; HDMI0_SDA,SCL / Bidir HDMI1 SDA Internally pulled up with a 1.8K. 5V tolerant
- (in symbol CM4, part K) BT_nDisable / Can be left floating if driven low the Bluetooth interface will be disabled. Internal pulled up / via 1.8K to CM4_3.3V; BT,WiFi Control; WL_nDisable / Can be left floating if driven low the wireless interface will be disabled. Internal pulled up via / 1.8K to CM4_3.3V
- (in symbol CM4, part L) Pi_nLED_Activity / Low Active Pi Activity LED. 20mA Max 5V tolerant ( VOL<0.4V). ( this is the signal that drives / the Green LED on the Raspberry Pi 4, Model B ); LEDs; PI_LED_nPWR / Low active Output to drive Power On LED. This signal needs to be buffered.
- (in symbol CM4, part M) Boot,Reset,Power Control; GLOBAL_EN (Input); Drive low to power off CM4. Internally pulled up with a 100K to +5V; nRPI_BOOT (Input); During boot if this pin is low booting from eMMC will be stopped and booting will be transferred to rpi boot which is via; nEXTRST (Output); Driven low during reset; Driven high (CM4_3.3V) once CM4 CPU has started to boot; Bidirectional pin. Internally pulled up to +3.3V via 10K / >Input / Can be driven low ( via a 220R resistor) to Reset the CM4 CPU. / Ouput > / Output a high signals Power Good and CPU running.; Analog IP0,IP1; Analog input of the MAX7704. Typically connected to CC pin of Type C power connector

### Library data of the parts
C55 C56 = Cap: Capacitor; Value: 100nF
CM1 = CM4: Raspberry Pi Compute Module 4 by Amornthep Phunsin
U28 = TPD12S016PWR: AN: 25112; Trenz-Stock: Yes; Mixed: SMT; Extra: HDMI Companion Chip with I2C Level Shifting Buffer, 12 Channel ESD; Case: TSSOP24; HelpURL: B:\AD\adlib\datasheet\TPD12S016; H-ART: TPD12S016PWR

## Sheet FPGA_Multiplexer.SchDoc
size A4
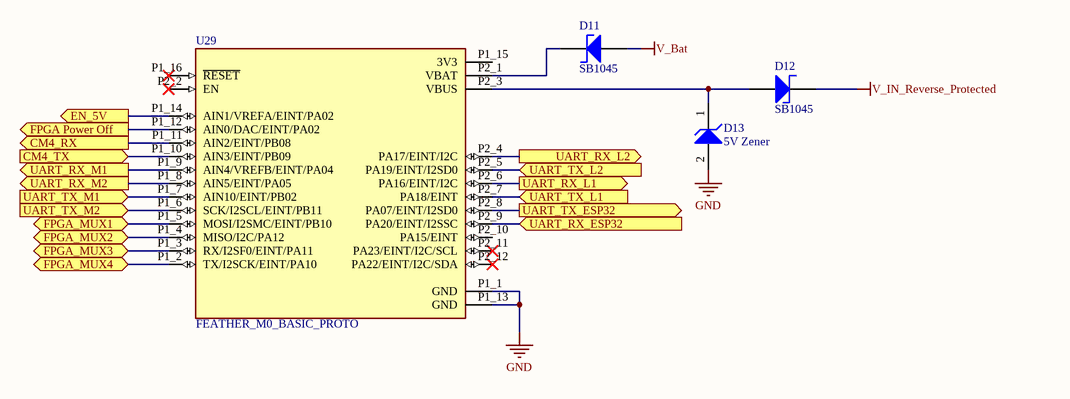
[diagram p16: FPGA_Multiplexer.SchDoc]

### Parts
D11  SB1045  [FP-95570-MFG]
D12  SB1045  [FP-95570-MFG]
D13  5V Zener  [ONSC-SMA-FL-2-403AA-01_V]
U29  FEATHER_M0_BASIC_PROTO  [MODULE_FEATHER_M0_BASIC_PROTO]

### Ports
CM4_RX (out), CM4_TX (in), EN_5V (out), FPGA Power Off (out), FPGA_MUX1 (bidir), FPGA_MUX2 (bidir), FPGA_MUX3 (bidir), FPGA_MUX4 (bidir), UART_RX_ESP32 (in), UART_RX_L1 (out), UART_RX_L2 (out), UART_RX_M1 (out), UART_RX_M2 (out), UART_TX_ESP32 (out), UART_TX_L1 (in), UART_TX_L2 (in), UART_TX_M1 (in), UART_TX_M2 (in)

### Nets
GND: D13.2(A) U29.P1_1(GND) U29.P1_13(GND)
V_Bat: D11.1(A)
V_IN_Reverse_Protected: D12.2(K)  [project net Vi]
CM4_RX: U29.P1_11(AIN2/EINT/PB08) ; port CM4_RX
CM4_TX: U29.P1_10(AIN3/EINT/PB09) ; port CM4_TX
EN_5V: U29.P1_14(AIN1/VREFA/EINT/PA02) ; port EN_5V
FPGA Power Off: U29.P1_12(AIN0/DAC/EINT/PA02) ; port FPGA Power Off
INT: U29.P1_5(MOSI/I2SMC/EINT/PB10) ; port FPGA_MUX1
UART_RX_ESP32: U29.P2_9(PA20/EINT/I2SSC) ; port UART_RX_ESP32
UART_RX_M1: U29.P1_9(AIN4/VREFB/EINT/PA04) ; port UART_RX_M1
UART_RX_M2: U29.P1_8(AIN5/EINT/PA05) ; port UART_RX_M2
UART_TX_ESP32: U29.P2_8(PA07/EINT/I2SD0) ; port UART_TX_ESP32
UART_TX_M1: U29.P1_7(AIN10/EINT/PB02) ; port UART_TX_M1
UART_TX_M2: U29.P1_6(SCK/I2SCL/EINT/PB11) ; port UART_TX_M2
NetD11_2: D11.2(K) U29.P2_1(VBAT)
NetD12_1: D12.1(A) D13.1(K) U29.P2_3(VBUS)
NetRF1_7: U29.P2_4(PA17/EINT/I2C) ; port UART_RX_L2
NetRF1_9: U29.P2_5(PA19/EINT/I2SD0) ; port UART_TX_L2
NetRF2_7: U29.P2_6(PA16/EINT/I2C) ; port UART_RX_L1
NetRF2_9: U29.P2_7(PA18/EINT) ; port UART_TX_L1
NetU9_10A: U29.P1_4(MISO/I2C/PA12) ; port FPGA_MUX2
NetU9_11A: U29.P1_3(RX/I2SF0/EINT/PA11) ; port FPGA_MUX3
NetU9_12A: U29.P1_2(TX/I2SCK/EINT/PA10) ; port FPGA_MUX4

Not connected (* = marked no-connect by the designer): U29 P1_15(3V3) P1_16(~{RESET})* P2_2(EN)* P2_10(PA15/EINT) P2_11(PA23/EINT/I2C/SCL)* P2_12(PA22/EINT/I2C/SDA)*

### Library data of the parts
D11 D12 = SB1045: 10.0A SCHOTTKY BARRIER RECTIFIER
D13 = CMP-1061-00270-1: 600 W Peak Power Zener Transient Voltage Suppressor, Unidirectional, 2-Pin SMA-FL, Pb-Free, Tape and Reel; PartNumber: NS6A12AFT3G; Manufacturer: On Semiconductor; IR Max (uA): 0.5; PPK Max (W): 600; V(BR) Typ (V): 14; ComponentLink3URL: http://www.onsemi.com/pub_link/Collateral/403AA.PDF; ComponentLink2Description: Datasheet; PackageReference: SMA-FL-2-403AA-01; PackageDescription: 2-Pin Small Molded Package, Body 2.6 x 4.3 mm; ComponentLink3Description: Package Specification; RoHS: Pb-Free; ComponentLink1Description: Manufacturer URL; ComponentLink2URL: http://www.onsemi.com/pub_link/Collateral/NS6A5.0AF-D.PDF; Direction: Unidirectional; Mounting Technology: Surface Mount; DatasheetVersion: Rev. 0; PackageVersion: Rev. O, 03/2011; ComponentLink1URL: http://www.onsemi.com/; Packing: Tape and Reel
U29 = FEATHER_M0_BASIC_PROTO: ATSAMD21G18 Feather M0 Basic Proto SAM D ARMÂ® CortexÂ®-M0+ MCU 32-Bit Embedded Evaluation Board; MF: Adafruit Industries; Value: *; Package: Package; Price: None; MP: Feather M0 Basic Proto; Availability: Unavailable

## Nets that join several sheets
5V_HDMI_A: VGA (C54.1 U27.11), Power Control (S8.1), Power Control/PS7 5V (6 pins), I2C Expanders (6 pins), CM4 (C56.1 U28.11)
GND: FPGA (13 pins), VGA (30 pins), Battery (12 pins), Power Control (14 pins), Power Control/PS1 (7 pins), Power Control/PS2 (7 pins), Power Control/PS3 (7 pins), Power Control/PS5 (7 pins), Power Control/PS6 (7 pins), Power Control/PS7 5V (8 pins), Power Control/PS4 (8 pins), I2C Expanders (23 pins), MEMS MICs (10 pins), Audio (5 pins), U_Audio/FA (7 pins), U_Audio/FB (7 pins), M1 (44 pins), M2 (44 pins), LoRa Radio (6 pins), Bluetooth & WIFI (ESP1.16), Sensors (15 pins), CM4 (56 pins), FPGA_Multiplexer (D13.2 U29.P1_1 U29.P1_13)
V_Bat: Battery (R63.1), Power Control (R44.1 R45.1 S4.3 U20.14), Power Control/PS1 (C44_PS1.1 U23_PS1.10 U23_PS1.11), Power Control/PS2 (C44_PS2.1 U23_PS2.10 U23_PS2.11), Power Control/PS3 (C44_PS3.1 U23_PS3.10 U23_PS3.11), Power Control/PS5 (C44_PS5.1 U23_PS5.10 U23_PS5.11), Power Control/PS6 (C44_PS6.1 U23_PS6.10 U23_PS6.11), Power Control/PS7 5V (C40_PS7_5V.1 U22_PS7_5V.10 U22_PS7_5V.11), Power Control/PS4 (C40_PS4.1 U22_PS4.10 U22_PS4.11), Sensors (D8.1 D8.2), FPGA_Multiplexer (D11.1)
VCC_FPGA: FPGA (21 pins), VGA (C52.2 R78.2 R79.2 U27.24), Battery (U31.1), Power Control/PS1 (6 pins), I2C Expanders (26 pins), U_Audio/FA (C24_FA.1 U11_FA.10), U_Audio/FB (C24_FB.1 U11_FB.10), M1 (J1_M1.21), M2 (J1_M2.21), Sensors (8 pins), CM4 (C55.2 U28.24)
VCC_LORA: Power Control/PS4 (6 pins), LoRa Radio (RF1.4 RF2.4)
VCC_MIC: Power Control (S8.2), MEMS MICs (10 pins), Audio (C14.1 U5.1 U5.8), Sensors (R51.1 R56.1 R70.1), CM4 (6 pins)
VCC_MODEM: Power Control/PS2 (6 pins), M1 (14 pins)
VCC_MODEM: Power Control/PS3 (6 pins), M2 (14 pins)
VCC_Screen: VGA (P3.4 P3.5 R76.1 U26.4), Power Control (C38.1 L1.1 U21.5), Power Control/PS5 (6 pins)
VCC_WIFI_BT: Power Control/PS6 (6 pins), Bluetooth & WIFI (ESP1.1)
Vi: Battery (12 pins), FPGA_Multiplexer (D12.2)
CEC_A: VGA (U27.1), I2C Expanders (U13.13), CM4 (U28.1)
CM4_RX: CM4 (CM1.51), FPGA_Multiplexer (U29.P1_11)
CM4_SCL1: FPGA (R81.2 U9.15A), CM4 (CM1.56)
CM4_SDA1: FPGA (R80.2 U9.13A), CM4 (CM1.58)
CM4_TX: CM4 (CM1.55), FPGA_Multiplexer (U29.P1_10)
CT_HPD: VGA (U27.12), I2C Expanders (U13.10)
EN_5V: Power Control/PS7 5V (U22_PS7_5V.12), FPGA_Multiplexer (U29.P1_14)
FPGA Power Off: Power Control (R44.2 U20.1), FPGA_Multiplexer (U29.P1_12)
HDMI_EN: VGA (U27.4 U27.5), I2C Expanders (U13.11)
HDMI_TX0_N: FPGA (U9.26A), VGA (J4.9 U27.17)
HDMI_TX0_P: FPGA (U9.25A), VGA (J4.7 U27.18)
HDMI_TX1_N: FPGA (U9.23A), VGA (J4.6 U27.20)
HDMI_TX1_P: FPGA (U9.24A), VGA (J4.4 U27.21)
HDMI_TX2_N: FPGA (U9.22A), VGA (J4.3 U27.22)
HDMI_TX2_P: FPGA (U9.21A), VGA (J4.1 U27.23)
HDMI_TXC_N: FPGA (U9.27A), VGA (J4.12 U27.15)
HDMI_TXC_P: FPGA (U9.28A), VGA (J4.10 U27.16)
Indicators: Power Control (S6.1), Power Control/PS1 (R50_PS1.2), Power Control/PS2 (R50_PS2.2), Power Control/PS3 (R50_PS3.2), Power Control/PS5 (R50_PS5.2), Power Control/PS6 (R50_PS6.2), Power Control/PS7 5V (R49_PS7_5V.2), Power Control/PS4 (R49_PS4.2)
INT: FPGA (U9.9A), Power Control (R45.2 S6.2 U20.4), I2C Expanders (Q10.3 R25.1 U12.15), M1 (Q2_M1.3), M2 (Q2_M2.3), Sensors (Q11.3 Q12.3 U25.3), FPGA_Multiplexer (U29.P1_5)
NetC36_1: VGA (U26.2), Power Control (C36.1 C37.1 D4.2 D5.3)
NetC39_1: VGA (U26.1), Power Control (C39.1 D5.1 R46.1 U21.3)
NetCM1_89: I2C Expanders (U13.5), CM4 (CM1.89)
NetCM1_91: I2C Expanders (U13.6), CM4 (CM1.91)
NetCM1_99: I2C Expanders (U13.4), CM4 (CM1.99)
NetCM1_170: FPGA (U9.40A), CM4 (CM1.170 U28.23)
NetCM1_172: FPGA (U9.39A), CM4 (CM1.172 U28.22)
NetCM1_176: FPGA (U9.42A), CM4 (CM1.176 U28.21)
NetCM1_178: FPGA (U9.41A), CM4 (CM1.178 U28.20)
NetCM1_182: FPGA (U9.43A), CM4 (CM1.182 U28.16)
NetCM1_184: FPGA (U9.44A), CM4 (CM1.184 U28.17)
NetCM1_188: FPGA (U9.48A), CM4 (CM1.188 U28.18)
NetCM1_190: FPGA (U9.47A), CM4 (CM1.190 U28.15)
NetESP1_5: I2C Expanders (U14.9), Bluetooth & WIFI (ESP1.5)
NetESP1_8: Audio (LS1.1), Bluetooth & WIFI (ESP1.8)
NetESP1_9: FPGA (U9.31A), Bluetooth & WIFI (ESP1.9)
NetESP1_10: Audio (LS1.2), Bluetooth & WIFI (ESP1.10)
NetESP1_11: FPGA (U9.30A), Bluetooth & WIFI (ESP1.11)
NetESP1_12: Audio (LS2.1), Bluetooth & WIFI (ESP1.12)
NetESP1_13: FPGA (U9.29A), Bluetooth & WIFI (ESP1.13)
NetESP1_14: Audio (LS2.2), Bluetooth & WIFI (ESP1.14)
NetESP1_15: FPGA (U9.32A), Bluetooth & WIFI (ESP1.15)
NetF2_FA_2: Audio (J2.3), U_Audio/FA (F2_FA.2)
NetF2_FB_2: Audio (J2.2), U_Audio/FB (F2_FB.2)
NetJ1_M1_5: FPGA (R11.2 U9.4A), M1 (J1_M1.5), M2 (J1_M2.5)
NetJ1_M1_8: FPGA (R8.2 R9.2 U9.3A U9.7A), M1 (J1_M1.8 J1_M1.19), M2 (J1_M2.8 J1_M2.19)
NetJ1_M1_18: FPGA (R10.2 U9.8A), M1 (J1_M1.18), M2 (J1_M2.18)
NetP3_1: FPGA (U9.42B), VGA (P3.1)
NetP3_2: FPGA (U9.40B), VGA (P3.2)
NetR17_FA_2: FPGA (U9.36A), U_Audio/FA (R17_FA.2)
NetR17_FB_2: FPGA (U9.35A), U_Audio/FB (R17_FB.2)
NetR39_1: FPGA (U9.8B), MEMS MICs (R39.1 R40.1)
NetR41_1: FPGA (U9.11B), MEMS MICs (R41.1)
NetR42_1: FPGA (U9.10B), MEMS MICs (R42.1 R43.1)
NetR76_2: VGA (R76.2 U26.31), I2C Expanders (U14.10)
NetRF1_7: LoRa Radio (RF1.7), FPGA_Multiplexer (U29.P2_4)
NetRF1_9: LoRa Radio (RF1.9), FPGA_Multiplexer (U29.P2_5)
NetRF2_7: LoRa Radio (RF2.7), FPGA_Multiplexer (U29.P2_6)
NetRF2_9: LoRa Radio (RF2.9), FPGA_Multiplexer (U29.P2_7)
NetS4_2: Power Control (S4.2), Power Control/PS1 (U23_PS1.12)
NetS5_1: Power Control (S5.1), I2C Expanders (U14.4)
NetS5_2: Power Control (S5.2), Power Control/PS2 (U23_PS2.12)
NetS7_1: Power Control (S7.1), I2C Expanders (U14.5)
NetS7_2: Power Control (S7.2), Power Control/PS3 (U23_PS3.12)
NetS9_1: Power Control (S9.1), I2C Expanders (U14.6)
NetS9_2: Power Control (S9.2), Power Control/PS4 (U22_PS4.12)
NetS10_1: Power Control (S10.1), I2C Expanders (U14.7)
NetS10_2: Power Control (S10.2), Power Control/PS6 (U23_PS6.12)
NetU1_M1_20: I2C Expanders (U14.17), M1 (U1_M1.20)
NetU1_M1_22: I2C Expanders (U14.13), M1 (U1_M1.22)
NetU1_M1_31: I2C Expanders (U14.11), M1 (U1_M1.31)
NetU1_M2_20: I2C Expanders (U14.16), M2 (U1_M2.20)
NetU1_M2_22: I2C Expanders (U14.15), M2 (U1_M2.22)
NetU1_M2_31: I2C Expanders (U14.14), M2 (U1_M2.31)
NetU4_M1_11: FPGA (U9.35B), M1 (U4_M1.11)
NetU4_M1_12: FPGA (U9.38B), M1 (U4_M1.12)
NetU4_M1_13: FPGA (U9.44B), M1 (U4_M1.13)
NetU4_M1_14: FPGA (U9.37B), M1 (U4_M1.14)
NetU4_M2_11: FPGA (U9.43B), M2 (U4_M2.11)
NetU4_M2_12: FPGA (U9.47B), M2 (U4_M2.12)
NetU4_M2_13: FPGA (U9.39B), M2 (U4_M2.13)
NetU4_M2_14: FPGA (U9.41B), M2 (U4_M2.14)
NetU5_6: FPGA (U9.9B), Audio (U5.6)
NetU9_10A: FPGA (U9.10A), FPGA_Multiplexer (U29.P1_4)
NetU9_11A: FPGA (U9.11A), FPGA_Multiplexer (U29.P1_3)
NetU9_12A: FPGA (U9.12A), FPGA_Multiplexer (U29.P1_2)
NetU9_12B: FPGA (U9.12B), VGA (U26.33)
NetU9_13B: FPGA (U9.13B), VGA (U26.32)
NetU9_14B: FPGA (U9.14B), VGA (U26.30)
NetU9_15B: FPGA (U9.15B), VGA (U26.28)
NetU9_16B: FPGA (U9.16B), VGA (U26.27)
NetU9_17B: FPGA (U9.17B), VGA (U26.26)
NetU9_18B: FPGA (U9.18B), VGA (U26.25)
NetU9_19B: FPGA (U9.19B), VGA (U26.24)
NetU9_20B: FPGA (U9.20B), VGA (U26.23)
NetU9_21B: FPGA (U9.21B), VGA (U26.20)
NetU9_22B: FPGA (U9.22B), VGA (U26.19)
NetU9_23B: FPGA (U9.23B), VGA (U26.18)
NetU9_24B: FPGA (U9.24B), VGA (U26.17)
NetU9_25B: FPGA (U9.25B), VGA (U26.16)
NetU9_26B: FPGA (U9.26B), VGA (U26.15)
NetU9_27B: FPGA (U9.27B), VGA (U26.12)
NetU9_28B: FPGA (U9.28B), VGA (U26.11)
NetU9_29B: FPGA (U9.29B), VGA (U26.10)
NetU9_30B: FPGA (U9.30B), VGA (U26.9)
NetU9_31B: FPGA (U9.31B), VGA (U26.8)
NetU9_32B: FPGA (U9.32B), VGA (U26.7)
NetU10_1: FPGA (U10.1), I2C Expanders (U13.14)
NetU10_3: FPGA (U10.3), I2C Expanders (U13.15)
NetU10_6: FPGA (U10.6), I2C Expanders (U13.16)
NetU10_7: FPGA (U10.7), I2C Expanders (U13.17)
NetU10_8: FPGA (U10.8), I2C Expanders (U13.19)
NetU10_9: FPGA (U10.9), I2C Expanders (U13.18)
NetU10_15: FPGA (U10.15), I2C Expanders (U13.20)
NetU11_FA_5: I2C Expanders (U14.18), U_Audio/FA (U11_FA.5 U11_FA.6), U_Audio/FB (U11_FB.5 U11_FB.6)
NetU12_10: I2C Expanders (U12.10), CM4 (U28.4 U28.5)
NetU13_7: VGA (U26.34), I2C Expanders (U13.7)
NetU13_8: Power Control (U21.4), I2C Expanders (U13.8)
NetU14_8: Power Control/PS5 (U23_PS5.12), I2C Expanders (U14.8)
NetU14_19: I2C Expanders (U14.19), CM4 (U28.12)
RESET_ESP32: I2C Expanders (U13.9), Bluetooth & WIFI (ESP1.3)
SCL: FPGA (R13.2 U9.36B), Battery (U31.5), I2C Expanders (U12.22 U13.22 U14.22), Bluetooth & WIFI (ESP1.4), Sensors (R53.2 U24.4 U25.6)
SCL_A: FPGA (U9.33A), VGA (R78.1 U27.2), CM4 (U28.2)
SDA: FPGA (R12.2 U9.34B), Battery (U31.4), I2C Expanders (U12.23 U13.23 U14.23), Bluetooth & WIFI (ESP1.6), Sensors (R54.2 U24.6 U25.5)
SDA_A: FPGA (U9.34A), VGA (R79.1 U27.3), CM4 (U28.3)
UART_RX_ESP32: Bluetooth & WIFI (ESP1.7), FPGA_Multiplexer (U29.P2_9)
UART_RX_M1: M1 (U2_M1.16), FPGA_Multiplexer (U29.P1_9)
UART_RX_M2: M2 (U2_M2.16), FPGA_Multiplexer (U29.P1_8)
UART_TX_ESP32: Bluetooth & WIFI (ESP1.2), FPGA_Multiplexer (U29.P2_8)
UART_TX_M1: M1 (U2_M1.14), FPGA_Multiplexer (U29.P1_7)
UART_TX_M2: M2 (U2_M2.14), FPGA_Multiplexer (U29.P1_6)